# Altium schematic sheet STM32_IO.SchDoc
size A3; SheetNumber: 3; SheetTotal: 14
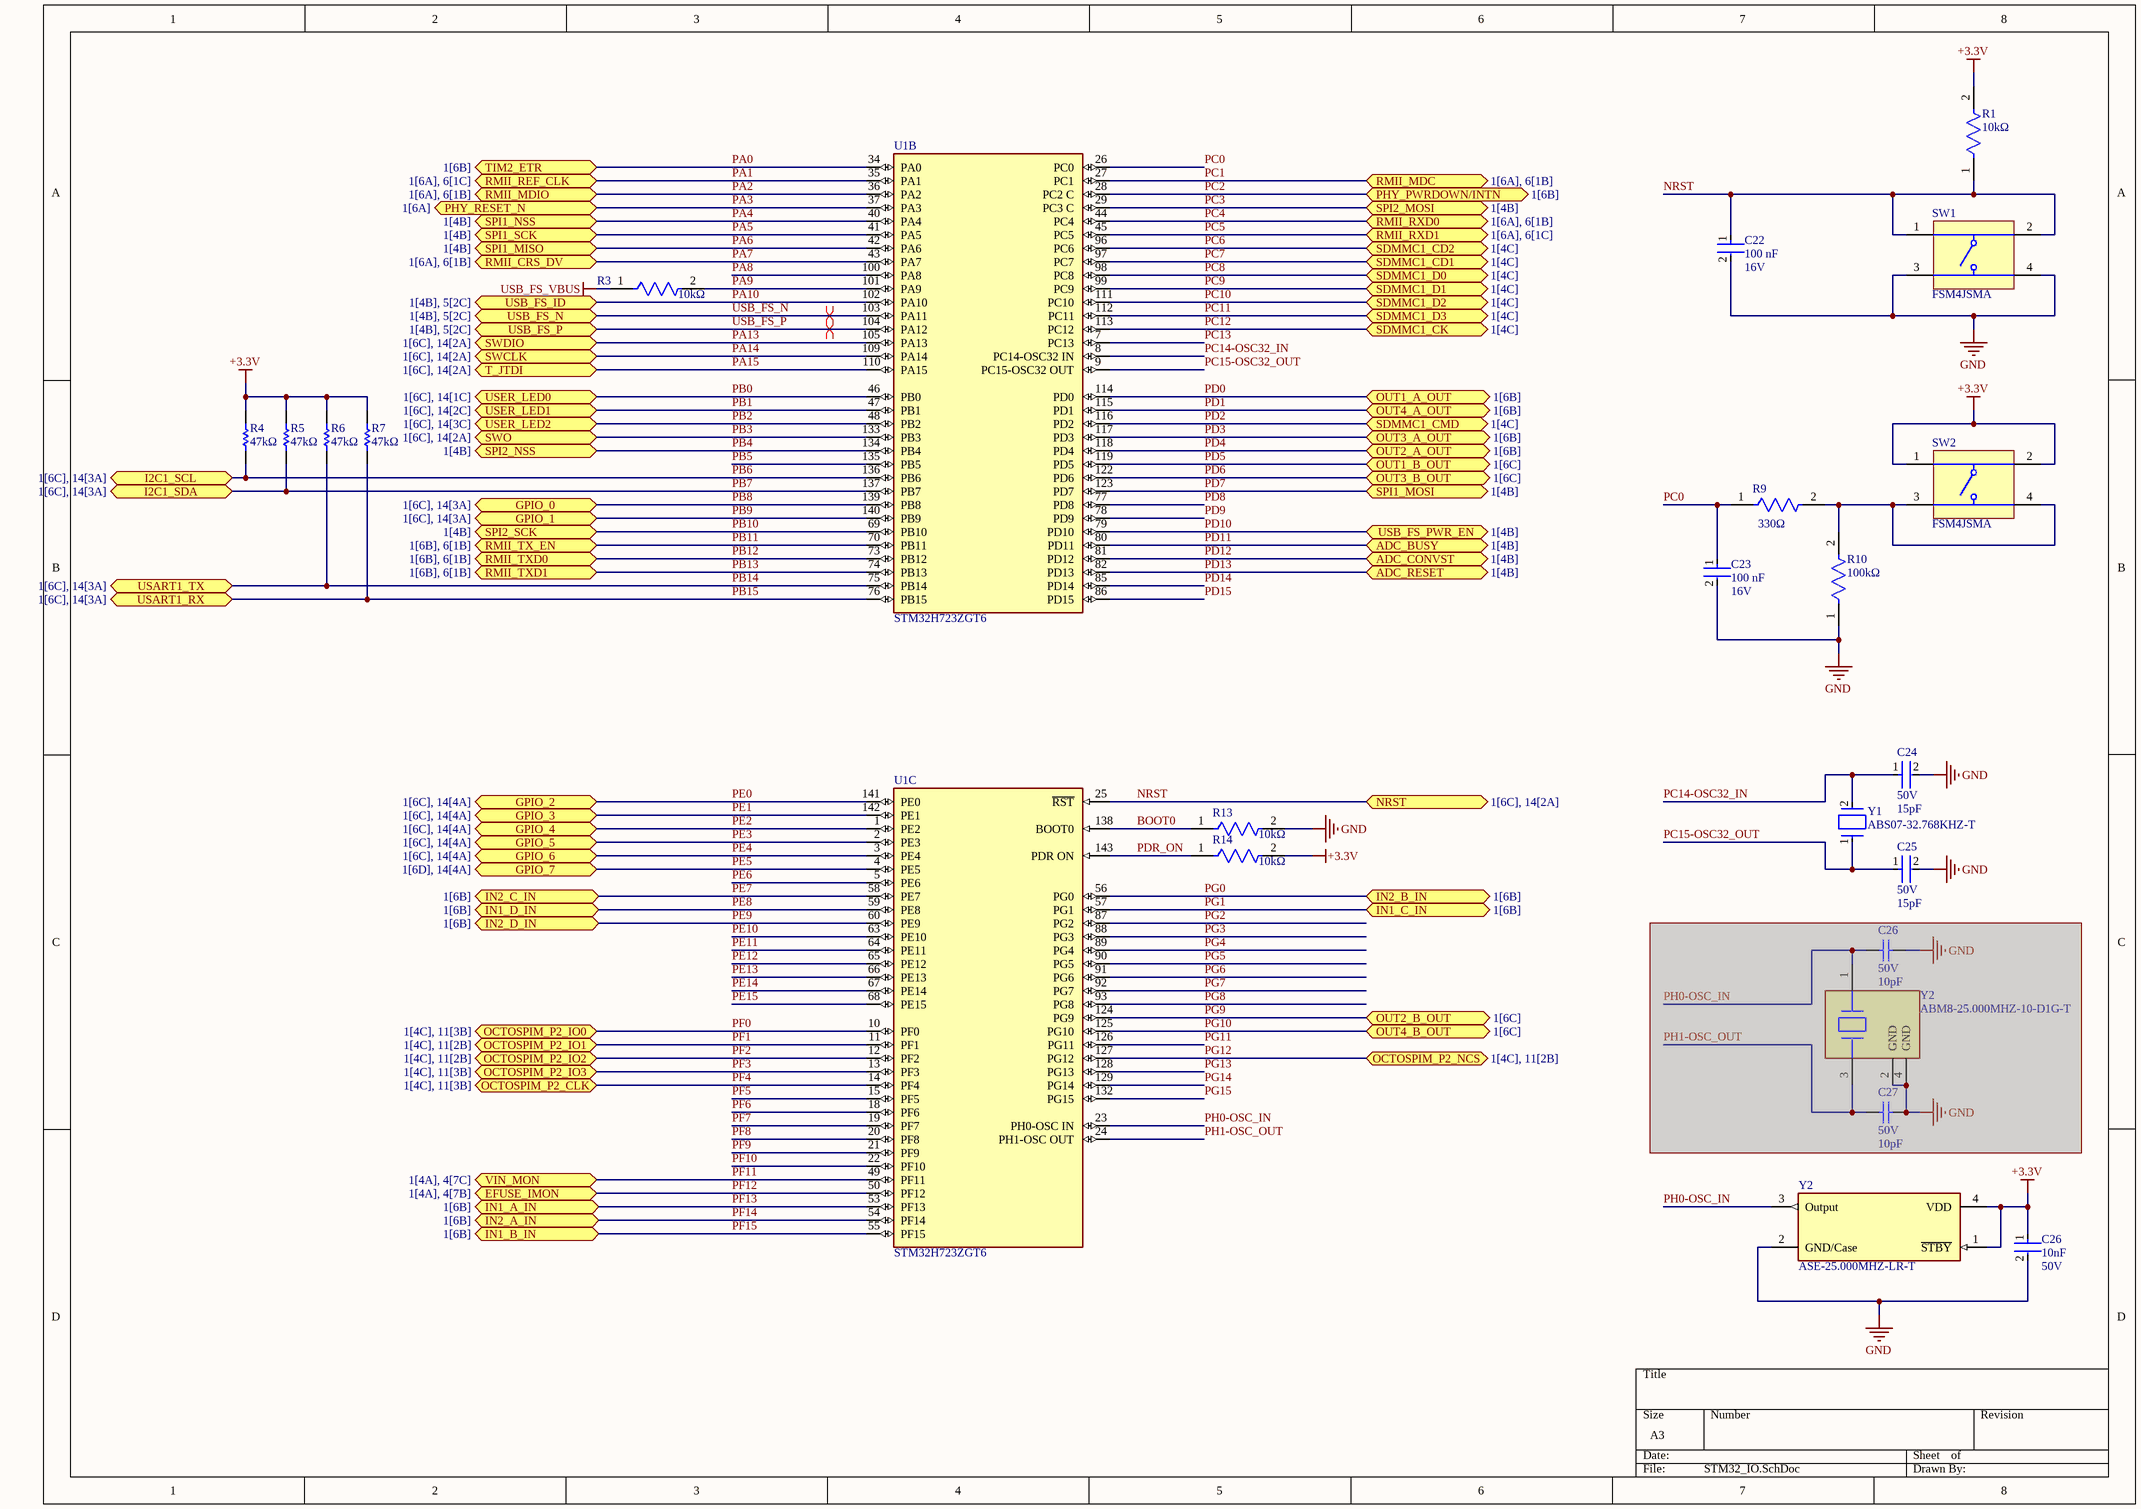
[diagram p0: STM32_IO.SchDoc]

## Parts
(Parts that share a designator on the sheet are numbered #1, #2 ... from top to bottom, then left to right.)
C22  Capacitance: 100 nF  Voltage Rating: 16V  [FP-CL752-IPC_B]  (hidden comment: CL05B104KO5VPNC)
C23  Capacitance: 100 nF  Voltage Rating: 16V  [FP-CL752-IPC_B]  (hidden comment: CL05B104KO5VPNC)
C24  Voltage: 50V  Capacitance: 15pF  [FP-0402-L_1_0_1-W_0_5_0_1-IPC_B]  (hidden comment: 04025A150JAT2A)
C25  Voltage: 50V  Capacitance: 15pF  [FP-0402-L_1_0_1-W_0_5_0_1-IPC_B]  (hidden comment: 04025A150JAT2A)
C26#1  Voltage Rating: 50V  Capacitance: 10pF  [CAPC1005X55X25NL05T05]  (hidden comment: CC0402JRNPO9BN100)  (masked out: inside a compile mask, not in the netlist)
C26#2  Voltage: 50V  Capacitance: 10nF  [FP-CL165-IPC_B]  (hidden comment: CL05B103KB5NNNC)
C27  Voltage Rating: 50V  Capacitance: 10pF  [CAPC1005X55X25NL05T05]  (hidden comment: CC0402JRNPO9BN100)  (masked out: inside a compile mask, not in the netlist)
R1  Resistance: 10kΩ  [FP-RC0603-0_55-IPC_B]  (hidden comment: RC0603FR-0710KL)
R3  Resistance: 10kΩ  [FP-RC0603-0_55-IPC_B]  (hidden comment: RC0603FR-0710KL)
R4  Resistance: 47kΩ  [RESC1608X55X25ML10T15]  (hidden comment: RC0603FR-1347KL)
R5  Resistance: 47kΩ  [RESC1608X55X25ML10T15]  (hidden comment: RC0603FR-1347KL)
R6  Resistance: 47kΩ  [RESC1608X55X25ML10T15]  (hidden comment: RC0603FR-1347KL)
R7  Resistance: 47kΩ  [RESC1608X55X25ML10T15]  (hidden comment: RC0603FR-1347KL)
R9  Resistance: 330Ω  [FP-CRCW0603-e3-MFG]  (hidden comment: CRCW0603330RFKEA)
R10  Resistance: 100kΩ  [FP-CRCW0603-e3-IPC_B]  (hidden comment: CRCW0603100KFKEC)
R13  Resistance: 10kΩ  [FP-RC0603-0_55-IPC_B]  (hidden comment: RC0603FR-0710KL)
R14  Resistance: 10kΩ  [FP-RC0603-0_55-IPC_B]  (hidden comment: RC0603FR-0710KL)
SW1  FSM4JSMA  [TECO-FSM4JSMA_V]
SW2  FSM4JSMA  [TECO-FSM4JSMA_V]
U1  STM32H723ZGT6  [CQFP50P2200X2200X160-144M]  (parts B,C of 3)
Y1  ABS07-32.768KHZ-T  [FP-ABS07-MFG]
Y2#1  ABM8-25.000MHZ-10-D1G-T  [FP-ABM8-MFG]  (masked out: inside a compile mask, not in the netlist)
Y2#2  ASE-25.000MHZ-LR-T  [FP-ASE-MFG]

## Ports
ADC_BUSY (bidir, see 1[4B]), ADC_CONVST (bidir, see 1[4B]), ADC_RESET (bidir, see 1[4B]), EFUSE_IMON (bidir, see 1[4A], 4[7B]), GPIO_0 (bidir, see 1[6C], 14[3A]), GPIO_1 (bidir, see 1[6C], 14[3A]), GPIO_2 (bidir, see 1[6C], 14[4A]), GPIO_3 (bidir, see 1[6C], 14[4A]), GPIO_4 (bidir, see 1[6C], 14[4A]), GPIO_5 (bidir, see 1[6C], 14[4A]), GPIO_6 (bidir, see 1[6C], 14[4A]), GPIO_7 (bidir, see 1[6D], 14[4A]), I2C1_SCL (bidir, see 1[6C], 14[3A]), I2C1_SDA (bidir, see 1[6C], 14[3A]), IN1_A_IN (bidir, see 1[6B]), IN1_B_IN (bidir, see 1[6B]), IN1_C_IN (bidir, see 1[6B]), IN1_D_IN (bidir, see 1[6B]), IN2_A_IN (bidir, see 1[6B]), IN2_B_IN (bidir, see 1[6B]), IN2_C_IN (bidir, see 1[6B]), IN2_D_IN (bidir, see 1[6B]), NRST (bidir, see 1[6C], 14[2A]), OCTOSPIM_P2_CLK (bidir, see 1[4C], 11[3B]), OCTOSPIM_P2_IO0 (bidir, see 1[4C], 11[3B]), OCTOSPIM_P2_IO1 (bidir, see 1[4C], 11[2B]), OCTOSPIM_P2_IO2 (bidir, see 1[4C], 11[2B]), OCTOSPIM_P2_IO3 (bidir, see 1[4C], 11[3B]), OCTOSPIM_P2_NCS (bidir, see 1[4C], 11[2B]), OUT1_A_OUT (bidir, see 1[6B]), OUT1_B_OUT (bidir, see 1[6C]), OUT2_A_OUT (bidir, see 1[6B]), OUT2_B_OUT (bidir, see 1[6C]), OUT3_A_OUT (bidir, see 1[6B]), OUT3_B_OUT (bidir, see 1[6C]), OUT4_A_OUT (bidir, see 1[6B]), OUT4_B_OUT (bidir, see 1[6C]), PHY_PWRDOWN/INTN (bidir, see 1[6B]), PHY_RESET_N (bidir, see 1[6A]), RMII_CRS_DV (bidir, see 1[6A], 6[1B]), RMII_MDC (bidir, see 1[6A], 6[1B]), RMII_MDIO (bidir, see 1[6A], 6[1B]), RMII_REF_CLK (bidir, see 1[6A], 6[1C]), RMII_RXD0 (bidir, see 1[6A], 6[1B]), RMII_RXD1 (bidir, see 1[6A], 6[1C]), RMII_TX_EN (bidir, see 1[6B], 6[1B]), RMII_TXD0 (bidir, see 1[6B], 6[1B]), RMII_TXD1 (bidir, see 1[6B], 6[1B]), SDMMC1_CD1 (bidir, see 1[4C]), SDMMC1_CD2 (bidir, see 1[4C]), SDMMC1_CK (bidir, see 1[4C]), SDMMC1_CMD (bidir, see 1[4C]), SDMMC1_D0 (bidir, see 1[4C]), SDMMC1_D1 (bidir, see 1[4C]), SDMMC1_D2 (bidir, see 1[4C]), SDMMC1_D3 (bidir, see 1[4C]), SPI1_MISO (bidir, see 1[4B]), SPI1_MOSI (bidir, see 1[4B]), SPI1_NSS (bidir, see 1[4B]), SPI1_SCK (bidir, see 1[4B]), SPI2_MOSI (bidir, see 1[4B]), SPI2_NSS (bidir, see 1[4B]), SPI2_SCK (bidir, see 1[4B]), SWCLK (bidir, see 1[6C], 14[2A]), SWDIO (bidir, see 1[6C], 14[2A]), SWO (bidir, see 1[6C], 14[2A]), T_JTDI (bidir, see 1[6C], 14[2A]), TIM2_ETR (bidir, see 1[6B]), USART1_RX (bidir, see 1[6C], 14[3A]), USART1_TX (bidir, see 1[6C], 14[3A]), USB_FS_ID (bidir, see 1[4B], 5[2C]), USB_FS_N (bidir, see 1[4B], 5[2C]), USB_FS_P (bidir, see 1[4B], 5[2C]), USB_FS_PWR_EN (bidir, see 1[4B]), USER_LED0 (bidir, see 1[6C], 14[1C]), USER_LED1 (bidir, see 1[6C], 14[2C]), USER_LED2 (bidir, see 1[6C], 14[3C]), VIN_MON (bidir, see 1[4A], 4[7C])

## Nets
+3.3V: C26#2.1 R1.2 R4.2 R5.2 R6.2 R7.2 R14.2 SW2.1 SW2.2 Y2#2.1(~{STBY}) Y2#2.4(VDD)
GND: C22.2 C23.2 C24.2 C25.2 C26#2.2 R10.1 R13.2 SW1.3 SW1.4 Y2#2.2(GND/Case)
USB_FS_VBUS: R3.1
BOOT0: R13.1 U1.138(BOOT0)
NRST: C22.1 R1.1 SW1.1 SW1.2 U1.25(~{RST}) ; port NRST
PA0: U1.34(PA0) ; port TIM2_ETR
PA1: U1.35(PA1) ; port RMII_REF_CLK
PA2: U1.36(PA2) ; port RMII_MDIO
PA3: U1.37(PA3) ; port PHY_RESET_N
PA4: U1.40(PA4) ; port SPI1_NSS
PA5: U1.41(PA5) ; port SPI1_SCK
PA6: U1.42(PA6) ; port SPI1_MISO
PA7: U1.43(PA7) ; port RMII_CRS_DV
PA8: U1.100(PA8)
PA9: R3.2 U1.101(PA9)
PA10: U1.102(PA10) ; port USB_FS_ID
PA13: U1.105(PA13) ; port SWDIO
PA14: U1.109(PA14) ; port SWCLK
PA15: U1.110(PA15) ; port T_JTDI
PB0: U1.46(PB0) ; port USER_LED0
PB1: U1.47(PB1) ; port USER_LED1
PB2: U1.48(PB2) ; port USER_LED2
PB3: U1.133(PB3) ; port SWO
PB4: U1.134(PB4) ; port SPI2_NSS
PB5: U1.135(PB5)
PB6: R4.1 U1.136(PB6) ; port I2C1_SCL
PB7: R5.1 U1.137(PB7) ; port I2C1_SDA
PB8: U1.139(PB8) ; port GPIO_0
PB9: U1.140(PB9) ; port GPIO_1
PB10: U1.69(PB10) ; port SPI2_SCK
PB11: U1.70(PB11) ; port RMII_TX_EN
PB12: U1.73(PB12) ; port RMII_TXD0
PB13: U1.74(PB13) ; port RMII_TXD1
PB14: R6.1 U1.75(PB14) ; port USART1_TX
PB15: R7.1 U1.76(PB15) ; port USART1_RX
PC0: C23.1 R9.1 U1.26(PC0)
PC1: U1.27(PC1) ; port RMII_MDC
PC2: U1.28(PC2_C) ; port PHY_PWRDOWN/INTN
PC3: U1.29(PC3_C) ; port SPI2_MOSI
PC4: U1.44(PC4) ; port RMII_RXD0
PC5: U1.45(PC5) ; port RMII_RXD1
PC6: U1.96(PC6) ; port SDMMC1_CD2
PC7: U1.97(PC7) ; port SDMMC1_CD1
PC8: U1.98(PC8) ; port SDMMC1_D0
PC9: U1.99(PC9) ; port SDMMC1_D1
PC10: U1.111(PC10) ; port SDMMC1_D2
PC11: U1.112(PC11) ; port SDMMC1_D3
PC12: U1.113(PC12) ; port SDMMC1_CK
PC13: U1.7(PC13)
PC14-OSC32_IN: C24.1 U1.8(PC14-OSC32_IN) Y1.2
PC15-OSC32_OUT: C25.1 U1.9(PC15-OSC32_OUT) Y1.1
PD0: U1.114(PD0) ; port OUT1_A_OUT
PD1: U1.115(PD1) ; port OUT4_A_OUT
PD2: U1.116(PD2) ; port SDMMC1_CMD
PD3: U1.117(PD3) ; port OUT3_A_OUT
PD4: U1.118(PD4) ; port OUT2_A_OUT
PD5: U1.119(PD5) ; port OUT1_B_OUT
PD6: U1.122(PD6) ; port OUT3_B_OUT
PD7: U1.123(PD7) ; port SPI1_MOSI
PD8: U1.77(PD8)
PD9: U1.78(PD9)
PD10: U1.79(PD10) ; port USB_FS_PWR_EN
PD11: U1.80(PD11) ; port ADC_BUSY
PD12: U1.81(PD12) ; port ADC_CONVST
PD13: U1.82(PD13) ; port ADC_RESET
PD14: U1.85(PD14)
PD15: U1.86(PD15)
PDR_ON: R14.1 U1.143(PDR_ON)
PE0: U1.141(PE0) ; port GPIO_2
PE1: U1.142(PE1) ; port GPIO_3
PE2: U1.1(PE2) ; port GPIO_4
PE3: U1.2(PE3) ; port GPIO_5
PE4: U1.3(PE4) ; port GPIO_6
PE5: U1.4(PE5) ; port GPIO_7
PE6: U1.5(PE6)
PE7: U1.58(PE7) ; port IN2_C_IN
PE8: U1.59(PE8) ; port IN1_D_IN
PE9: U1.60(PE9) ; port IN2_D_IN
PE10: U1.63(PE10)
PE11: U1.64(PE11)
PE12: U1.65(PE12)
PE13: U1.66(PE13)
PE14: U1.67(PE14)
PE15: U1.68(PE15)
PF0: U1.10(PF0) ; port OCTOSPIM_P2_IO0
PF1: U1.11(PF1) ; port OCTOSPIM_P2_IO1
PF2: U1.12(PF2) ; port OCTOSPIM_P2_IO2
PF3: U1.13(PF3) ; port OCTOSPIM_P2_IO3
PF4: U1.14(PF4) ; port OCTOSPIM_P2_CLK
PF5: U1.15(PF5)
PF6: U1.18(PF6)
PF7: U1.19(PF7)
PF8: U1.20(PF8)
PF9: U1.21(PF9)
PF10: U1.22(PF10)
PF11: U1.49(PF11) ; port VIN_MON
PF12: U1.50(PF12) ; port EFUSE_IMON
PF13: U1.53(PF13) ; port IN1_A_IN
PF14: U1.54(PF14) ; port IN2_A_IN
PF15: U1.55(PF15) ; port IN1_B_IN
PG0: U1.56(PG0) ; port IN2_B_IN
PG1: U1.57(PG1) ; port IN1_C_IN
PG2: U1.87(PG2)
PG3: U1.88(PG3)
PG4: U1.89(PG4)
PG5: U1.90(PG5)
PG6: U1.91(PG6)
PG7: U1.92(PG7)
PG8: U1.93(PG8)
PG9: U1.124(PG9) ; port OUT2_B_OUT
PG10: U1.125(PG10) ; port OUT4_B_OUT
PG11: U1.126(PG11)
PG12: U1.127(PG12) ; port OCTOSPIM_P2_NCS
PG13: U1.128(PG13)
PG14: U1.129(PG14)
PG15: U1.132(PG15)
PH0-OSC_IN: U1.23(PH0-OSC_IN) Y2#2.3(Output)
PH1-OSC_OUT: U1.24(PH1-OSC_OUT)
USB_FS_N: U1.103(PA11) ; port USB_FS_N
USB_FS_P: U1.104(PA12) ; port USB_FS_P
NetR9_2: R9.2 R10.2 SW2.3 SW2.4

## Layout directives
differential pair: USB_FS_N, USB_FS_P

## Library data of the parts
C22 C23 = CMP-13271-002128-1: Cap Ceramic 100nF 16V X7R ±10% SMD 0402 +125°C Paper T/R; Length: 0.039inch; Case Code (Metric): 1005; Thickness: 0.022inch; Max Operating Temperature: 125°C; Mount: Surface Mount; Features: Soft Termination; Width: 0.02inch; Min Operating Temperature: -55°C; Tolerance: 10%; Case/Package: 0402; Packaging: Cut Tape; Ratings: AEC-Q200; Case Code (Imperial): 0402; Lead Free: Lead Free
C24 C25 = CMP-2008-02583-2: General Purpose Ceramic Capacitor, 0402, 15pF, 5%, C0G, 30ppm/°C, 50V; Lead Free: Lead Free; Max Operating Temperature: 125°C; Contact Plating: Tin; Temperature Coefficient: 30ppm/°C; Number of Pins: 2; Width: 0.5mm; Voltage Rating (DC): 50V; Mount: Surface Mount; Min Operating Temperature: -55°C; Termination: SMD/SMT; RoHS Compliant: Yes; Construction: Flat; Tolerance: 5%; Case Code (Imperial): 0402; Case/Package: 0402; Dielectric: C0G; Case Code (Metric): 1005; Series: -; Length: 1mm; Height: 0.5mm; REACH SVHC: No SVHC; Package Quantity: 1; Voltage Rating: 50V; Depth: 0.5mm; Radiation Hardening: No; Thickness: 0.022inch; Packaging: Tape and Reel
C26#1 C27 = CMP-2100-03589-1: Chip Capacitor, 10 pF, +/- 5%, 50 V, -55 to 125 degC, 0402 (1005 Metric), RoHS, Tape and Reel; Manufacturer: Yageo; Insulation Resistance: 100GR; Dielectric Material: Ceramic; Temperature Coefficient: 30ppm/degC; Dielectric: C0G; Termination: SMD/SMT; Package Reference: 0402; Voltage Rating (DC): 50V; Lead Free: LeadFree; Composition: Ceramic; Tolerance: 5%; Case Code (Metric): 1005; Packaging: TapeandReel; Manufacturer URL: http://www.yageo.com/; REACH SVHC: NoSVHC; Max Operating Temperature: 125degC; Length: 1mm; Mount: SurfaceMount; Depth: 0.5mm; Min Operating Temperature: -55degC; Number of Pins: 2; Width: 0.02inch; Datasheet Version: Rev. 14, 07/2016; Package Quantity: 1; Datasheet URL: http://www.yageo.com/documents/recent/UPY-GP_NP0_16V-to-50V_14.pdf; Case Code (Imperial): 0402; RoHSCompliant: True; Radiation Hardening: No; Height: 0.5mm; Case/Package: 0402; Thickness: 0.022inch; Package Description: 2-Pin Surface Mount Device, Body 1 x 0.5 mm; Voltage: 50V
C26#2 = CMP-13271-000387-1: Cap Ceramic 10nF 50V X7R ±10% SMD 0402 +125°C Paper T/R; Depth: 0.5mm; Length: 1mm; Lead Free: Lead Free; Case Code (Metric): 1005; Width: 0.02inch; Min Operating Temperature: -55°C; Thickness: 0.022inch; Package Quantity: 1; Mount: Surface Mount; Height: 0.5mm; Material: Ceramic; Tolerance: 10%; Case Code (Imperial): 0402; Radiation Hardening: No; Case/Package: 0402; Max Operating Temperature: 125°C; Voltage Rating (DC): 50V; Contact Plating: Tin; Packaging: Tape and Reel; Voltage Rating: 50V; Dielectric: X7R
R1 R3 R13 R14 = CMP-2100-03664-2: RES 10K OHM 1% 1/10W 0603; Voltage Rating: 75V; Voltage Rating (DC): 50V; Power Rating: 100mW; Temperature Coefficient: 100ppm/°C; Depth: 0.8mm; Termination: SMD/SMT; Resistor Type: Thick Film; Series: RC; Construction: Rectangular; Features: Moisture Resistant; Packaging: Tape and Reel; Min Operating Temperature: -55°C; Number of Terminations: 2; Lead Pitch: 0.3mm; RoHS Compliant: Yes; Case/Package: 0603; Resistance Tolerance: 1%; Military Standard: Not; Weight: 7.1E-05oz; Number of Pins: 2; Tolerance: 1%; Length: 1.6mm; Case Code (Imperial): 0603; Lead Free: Lead Free; Width: 0.8mm; Max Power Dissipation: 100mW; Height: 0.45mm; Max Operating Temperature: 155°C; Case Code (Metric): 1608; Size Code: 0603
R4-R7 = CMP-2000-04221-1: Manufacturer: Yageo; Part Number: RC0603FR-1347KL
R9 = CMP-1012-00454-3: RES Thick Film, 330Ω, 1%, 0.1W, 100ppm/°C, 0603; Voltage Rating: 75V; Max Power Dissipation: 100mW; Depth: 0.85mm; Contact Plating: Tin; Package Quantity: 10; Termination: SMD/SMT; Tolerance: 1%; Height: 0.45mm; Number of Terminations: 2; Radiation Hardening: No; Features: Automotive AEC-Q200; Case/Package: 0603; Mount: Surface Mount; Case Code (Metric): 1608; Lead Free: Lead Free; Temperature Coefficient: 100ppm/°C; Weight: 7.1E-05oz; Military Standard: Not; Packaging: Tape and Reel; Max Operating Temperature: 155°C; Voltage Rating (DC): 75V; Length: 1.55mm; Min Operating Temperature: -55°C; Composition: Thick Film; Case Code (Imperial): 0603; Width: 0.033inch; Power Rating: 100mW
R10 = CMP-2000-03822-2: RES Thick Film, 100kΩ, 1%, 0.1W, 100ppm/°C, 0603; Power Rating: 100mW; Height: 0.02inch; Min Operating Temperature: -55°C; Length: 0.061inch; Temperature Coefficient: 100ppm/°C; Number of Terminations: 2; Packaging: Tape and Reel; Case Code (Imperial): 0603; Case/Package: 0603; Contact Plating: Tin; Radiation Hardening: No; Lead Free: Lead Free; Depth: 0.85mm; Case Code (Metric): 1608; Max Power Dissipation: 100mW; Features: Automotive AEC-Q200; Tolerance: 1%; Max Operating Temperature: 155°C; Composition: Thick Film; Military Standard: Not; Width: 0.033inch
SW1 SW2 = CMP-2000-05602-2: Swicth, SPST, 24 V, -35 to 85 degC, 4-Pin SMD, RoHS, Tape and Reel; Manufacturer: TE Connectivity; Switch Travel: 0.25mm; Mechanical Life: 100000Cycles; Contact Current Rating: 50mA; Operating Force: 1.57N; Actuator Material: Polyamide; Contact Resistance: 100mOhm; Voltage Rating: 24V; Illumination Type: Illuminated; Actuator Length: 0.055inch; Max Voltage Rating (DC): 12V; Case\/Package: SMD/SMT; Orientation: Straight; Datasheet URL: http://www.te.com/commerce/DocumentDelivery/DDEController?Action=showdoc&DocId=Customer+Drawing%7F2-1437565-7%7FV%7Fpdf%7FEnglish%7FENG_CD_2-1437565-7_V.pdf%7F4-1437565-2; Min Operating Temperature: -35degC; Packaging: LoosePiece; Termination: GullWing; Throw Configuration: SPST; Package Description: 4-Pin Surface Mount Device, Body 6 x 6 mm, Pitch 4.5 mm; Mounting Technology: SurfaceMount; Contact Plating: Silver; Datasheet Version: Rev. V, 02/2015; RoHSCompliant: true; Max Operating Temperature: 85degC; Length: 6mm; Voltage Rating (DC): 24V; Electrical Life: 100000Cycles; Current Rating: 50mA; Package Quantity: 750; Mount: SurfaceMount; Package Reference: FSM4JSMA; Manufacturer URL: http://www.te.com/; Width: 6mm; REACH SVHC: Unknown; Contact Material: CopperAlloy
U1 = STM32H723ZGT6: RISC Microcontroller, 32-Bit, FLASH, CORTEX-M7 CPU, 550MHz, CMOS, PQFP144; Manufacturer: STMicroelectronics; Interface: 39,40,224,1514,1515,1518,1532,1533Interface; Memory Format: 4498,11064MemoryType; Data Bus Width: 32b; Density: 1MB; Max Supply Voltage: 3.6V; Min Supply Voltage: 1.62V; Nominal Supply Current: 4uA; Number of A/D Converters: 1NUMBER; Number of ADC Channels: 16NUMBER; Number of I2C Channels: 5NUMBER; Number of I/Os: 112NUMBER; Number of SPI Channels: 6NUMBER; Number of Timers/Counters: 4NUMBER; RAM Size: 564KB; Supplier: Arrow Electronics; Supplier Part Number: STM32H723ZGT6; Manufacturer Part Number: STM32H723ZGT6; RoHS: No; Category: Microcontrollers; Stock: 2596; Pricing: 1=9.275, 10=9.182, 25=9.09, 50=8.999, 120=8.909, 300=8.175, 540=8.094 (USD); Min Operating Temperature: -40°C; Max Operating Temperature: 85°C; Frequency: 550MHz; Memory Size: 1MB; Number of Ethernet Channels: 1NUMBER; Number of UART Channels: 6NUMBER; Number of USB Channels: 1NUMBER; Height: 1.6mm
Y1 = CMP-0447-00001-4: Crystal 32.768kHz ±20ppm (Tol) 12.5pF FUND 70kΩ 2-Pin CSMD T/R; ESR (Equivalent Series Resistance): 70kR; Radiation Hardening: No; Frequency: 32.768kHz; Length: 3.2mm; Max Operating Temperature: 85°C; Number of Pins: 2; Series: ABS07; Min Operating Temperature: -40°C; Frequency Tolerance: 20ppm; Packaging: Tape and Reel; Height: 0.9mm; Width: 1.5mm; Depth: 1.5mm; Load Capacitance: 12.5pF; RoHS Compliant: Yes; Tolerance: 20ppm; Termination: SMD/SMT; Lead Free: Lead Free; Series Resistance: 70kR; REACH SVHC: No SVHC; Case/Package: CSMD; Operating Frequency: 32.768 kHz; Package Quantity: 3000
Y2#1 = CMP-27762-010178-1: Crystal 25MHz ±10ppm 10pF SMD-4 3.2mm x 2.5mm; Frequency Stability: 15ppm; ESR (Equivalent Series Resistance): 50R; Mount: Surface Mount; Load Capacitance: 10pF; Frequency Tolerance: 10ppm; Max Operating Temperature: 85°C; Frequency: 25MHz; Case/Package: SMD/SMT; Length: 0.126inch; RoHS Compliant: Yes; Min Operating Temperature: -40°C; Width: 0.098inch; Height: 0.031inch; Packaging: Tape and Reel
Y2#2 = CMP-27762-000357-1: XTAL Oscillator 25MHz ±25ppm CMOS 3.3V 4-SMD 3.2mm x 2.5mm; Min Supply Voltage: 3.135V; Max Supply Current: 13mA; Max Supply Voltage: 3.465V; Load Capacitance: 15pF; Height: 0.047inch; Series: ASE; Frequency Stability: 25ppm; Mount: Surface Mount; Case/Package: SMD/SMT; Width: 0.098inch; Operating Frequency: 25 MHz; REACH SVHC: No SVHC; Package Quantity: 1000; Number of Pins: 4; Termination: SMD/SMT; Frequency: 25MHz; Max Operating Temperature: 85°C; Packaging: Tape and Reel; Min Operating Temperature: -40°C; Lead Free: Lead Free; Length: 0.126inch; Operating Supply Voltage: 3.3V